# EAGLE schematic Projekt zasilanie + przekaźniki (EAGLE 9.6.2)
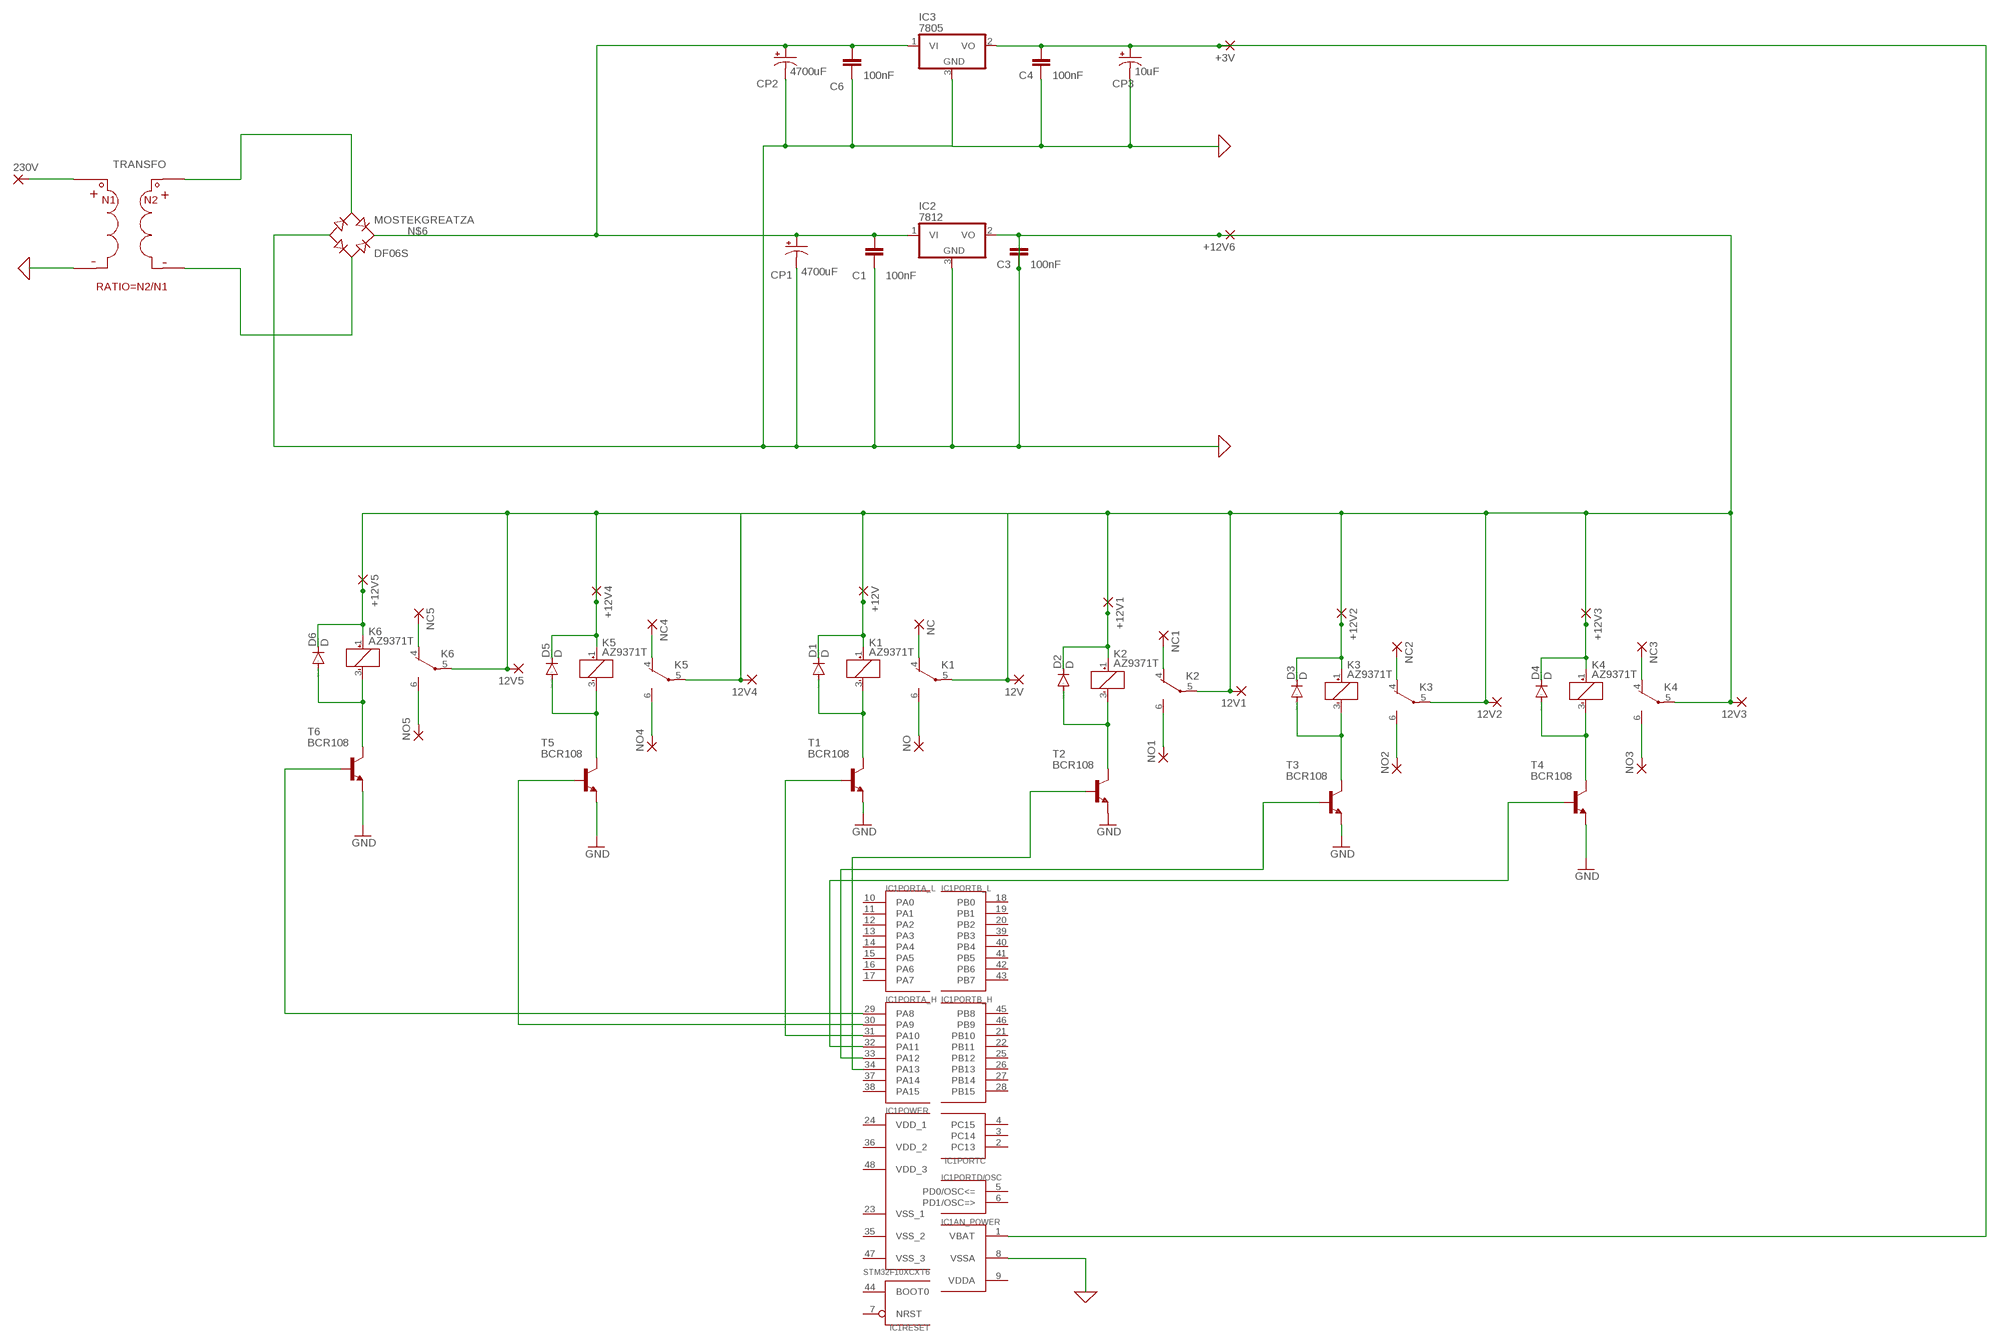
[diagram p0: schematic, sheet 1]

## Parts
12V  SMD2  [SMD1,27-2,54]
12V1  SMD2  [SMD1,27-2,54]
12V2  SMD2  [SMD1,27-2,54]
12V3  SMD2  [SMD1,27-2,54]
12V4  SMD2  [SMD1,27-2,54]
12V5  SMD2  [SMD1,27-2,54]
230V  SMD2  [SMD1,27-2,54]
+3V  SMD2  [SMD1,27-2,54]
+12V  SMD2  [SMD1,27-2,54]
+12V1  SMD2  [SMD1,27-2,54]
+12V2  SMD2  [SMD1,27-2,54]
+12V3  SMD2  [SMD1,27-2,54]
+12V4  SMD2  [SMD1,27-2,54]
+12V5  SMD2  [SMD1,27-2,54]
+12V6  SMD2  [SMD1,27-2,54]
C1  100nF  C  (no package)
C3  100nF  C  (no package)
C4  100nF  C  (no package)
C6  100nF  C  (no package)
CP1  4700uF  CPOL-US153CLV-0605  [153CLV-0605]
CP2  4700uF  CPOL-US153CLV-0605  [153CLV-0605]
CP3  10uF  CPOL-US153CLV-0605  [153CLV-0605]
D1  D  1N4004  [DO41-10]
D2  D  1N4004  [DO41-10]
D3  D  1N4004  [DO41-10]
D4  D  1N4004  [DO41-10]
D5  D  1N4004  [DO41-10]
D6  D  1N4004  [DO41-10]
IC1  STM32F10XCXT6  [TQFP48]
IC2  7812  7818DT  [TO252]
IC3  7805  7808DT  [TO252]
K1  AZ9371T  TK1-5V  [TK]
K2  AZ9371T  TK1-5V  [TK]
K3  AZ9371T  TK1-5V  [TK]
K4  AZ9371T  TK1-5V  [TK]
K5  AZ9371T  TK1-5V  [TK]
K6  AZ9371T  TK1-5V  [TK]
MOSTEKGREATZA  DF06S  [DFS]
NC  SMD2  [SMD1,27-2,54]
NC1  SMD2  [SMD1,27-2,54]
NC2  SMD2  [SMD1,27-2,54]
NC3  SMD2  [SMD1,27-2,54]
NC4  SMD2  [SMD1,27-2,54]
NC5  SMD2  [SMD1,27-2,54]
NO  SMD2  [SMD1,27-2,54]
NO1  SMD2  [SMD1,27-2,54]
NO2  SMD2  [SMD1,27-2,54]
NO3  SMD2  [SMD1,27-2,54]
NO4  SMD2  [SMD1,27-2,54]
NO5  SMD2  [SMD1,27-2,54]
T1  BCR108  2N1613  [TO5]
T2  BCR108  2N1613  [TO5]
T3  BCR108  2N1613  [TO5]
T4  BCR108  2N1613  [TO5]
T5  BCR108  2N1613  [TO5]
T6  BCR108  2N1613  [TO5]
TRANSFO  TRANSFORMER  (no package)

## Nets
0: 12V1.1(P) 12V2.1(P) 12V3.1(P) 12V4.1(P) 12V5.1(P) 12V.1(P) +12V1.1(P) +12V2.1(P) +12V3.1(P) +12V4.1(P) +12V5.1(P) +12V6.1(P) +12V.1(P) C1.2 C3.1 C3.2 C4.2 C6.2 CP1.- CP2.- CP3.- D1.C D2.C D3.C D4.C D5.C D6.C IC1.8(AN_POWER:VSSA) IC2.2(VO) IC2.3(GND) IC3.3(GND) K1.1(-:+) K1.5(1:P) K2.1(-:+) K2.5(1:P) K3.1(-:+) K3.5(1:P) K4.1(-:+) K4.5(1:P) K5.1(-:+) K5.5(1:P) K6.1(-:+) K6.5(1:P) MOSTEKGREATZA.- TRANSFO.P$2 ; supply symbol labelled GND
GND: T1.1(E) T2.1(E) T3.1(E) T4.1(E) T5.1(E) T6.1(E)
N$1: IC1.31(PORTA_H:PA10) T1.2(B)
N$2: D1.A K1.3(-:-) T1.3(C)
N$3: K1.6(1:S) NO.1(P)
N$5: K1.4(1:O) NC.1(P)
N$6: C1.1 C6.1 CP1.+ CP2.+ IC2.1(VI) IC3.1(VI) MOSTEKGREATZA.+
N$7: IC1.34(PORTA_H:PA13) T2.2(B)
N$8: D2.A K2.3(-:-) T2.3(C)
N$10: K2.6(1:S) NO1.1(P)
N$11: K2.4(1:O) NC1.1(P)
N$13: IC1.33(PORTA_H:PA12) T3.2(B)
N$14: D3.A K3.3(-:-) T3.3(C)
N$16: K3.6(1:S) NO2.1(P)
N$17: K3.4(1:O) NC2.1(P)
N$19: IC1.32(PORTA_H:PA11) T4.2(B)
N$20: D4.A K4.3(-:-) T4.3(C)
N$22: K4.6(1:S) NO3.1(P)
N$23: K4.4(1:O) NC3.1(P)
N$25: IC1.30(PORTA_H:PA9) T5.2(B)
N$26: D5.A K5.3(-:-) T5.3(C)
N$28: K5.6(1:S) NO4.1(P)
N$29: K5.4(1:O) NC4.1(P)
N$31: IC1.29(PORTA_H:PA8) T6.2(B)
N$32: D6.A K6.3(-:-) T6.3(C)
N$34: K6.6(1:S) NO5.1(P)
N$35: K6.4(1:O) NC5.1(P)
N$37: +3V.1(P) C4.1 CP3.+ IC1.1(AN_POWER:VBAT) IC3.2(VO)
N$38: MOSTEKGREATZA.AC1 TRANSFO.P$3
N$39: MOSTEKGREATZA.AC2 TRANSFO.P$4
N$40: 230V.1(P) TRANSFO.P$1
Unconnected: IC1.2(PORTC:PC13) IC1.3(PORTC:PC14) IC1.4(PORTC:PC15) IC1.5(PORTD/OSC:PD0/OSC<=) IC1.6(PORTD/OSC:PD1/OSC=>) IC1.7(RESET:NRST) IC1.10(PORTA_L:PA0) IC1.11(PORTA_L:PA1) IC1.12(PORTA_L:PA2) IC1.13(PORTA_L:PA3) IC1.14(PORTA_L:PA4) IC1.15(PORTA_L:PA5) IC1.16(PORTA_L:PA6) IC1.17(PORTA_L:PA7) IC1.18(PORTB_L:PB0) IC1.19(PORTB_L:PB1) IC1.20(PORTB_L:PB2) IC1.21(PORTB_H:PB10) IC1.22(PORTB_H:PB11) IC1.25(PORTB_H:PB12) IC1.26(PORTB_H:PB13) IC1.27(PORTB_H:PB14) IC1.28(PORTB_H:PB15) IC1.37(PORTA_H:PA14) IC1.38(PORTA_H:PA15) IC1.39(PORTB_L:PB3) IC1.40(PORTB_L:PB4) IC1.41(PORTB_L:PB5) IC1.42(PORTB_L:PB6) IC1.43(PORTB_L:PB7) IC1.44(RESET:BOOT0) IC1.45(PORTB_H:PB8) IC1.46(PORTB_H:PB9)

## Power pins joined to a net without a drawn wire
VDD_1: IC1.24(POWER:VDD_1)
VDD_2: IC1.36(POWER:VDD_2)
VDD_3: IC1.48(POWER:VDD_3)
VDDA: IC1.9(AN_POWER:VDDA)
VSS_1: IC1.23(POWER:VSS_1)
VSS_2: IC1.35(POWER:VSS_2)
VSS_3: IC1.47(POWER:VSS_3)

## Library data of the parts
12V 12V1-12V5 230V +3V +12V +12V1-+12V6 NC NC1-NC5 NO NO1-NO5 = wirepad:SMD2: SMD PAD
C1 C3 C4 C6 = ngspice-simulation:C: CAPACITOR
CP1-CP3 = rcl:CPOL-US: POLARIZED CAPACITOR, American symbol; SPICEPREFIX: C
D1-D6 = diode:1N4004: DIODE general purpose rectifier, 1 A
IC1 = stm32:STM32F10XCXT6: ST STM32F101/103 48pin LQFP
IC2 IC3 = linear:78*: Positive VOLTAGE REGULATOR Source: http://cache.national.com/ds/LM/LM78L05.pdf http://www.fairchildsemi.com/ds/LM/LM7805.pdf; SPICEPREFIX: J
K1-K6 = relay:TK1-?*: ULTRA LOW PROFILE 2 AMP. POLARIZED RELAY NAiS Source: http://www.mew-europe.com/.. en_ds_61018_0000.pdf; MF: AROMAT/ MATSUSHITA; MPN: TK1-5V; OC_FARNELL: 1380960; OC_NEWARK: 64K3183
MOSTEKGREATZA = rectifier:DF*S: Surface Mount Glass Passivated Bridge Rectifiers Source: Source: Comchip Bridge Rectifiers DF005S-G thru DF10S-G.pdf
T1-T6 = transistor:2N1613: NPN TRANSISTOR
TRANSFO = ngspice-simulation:TRANSFORMER: Coupled inductors The RATIO is defined in the schematic by using the text command and adding a line that says: .PARAM RATIO=x Where x is the turns ratio of the transformer